# EAGLE design TZATZIKI_v4 (EAGLE 7.6.0)
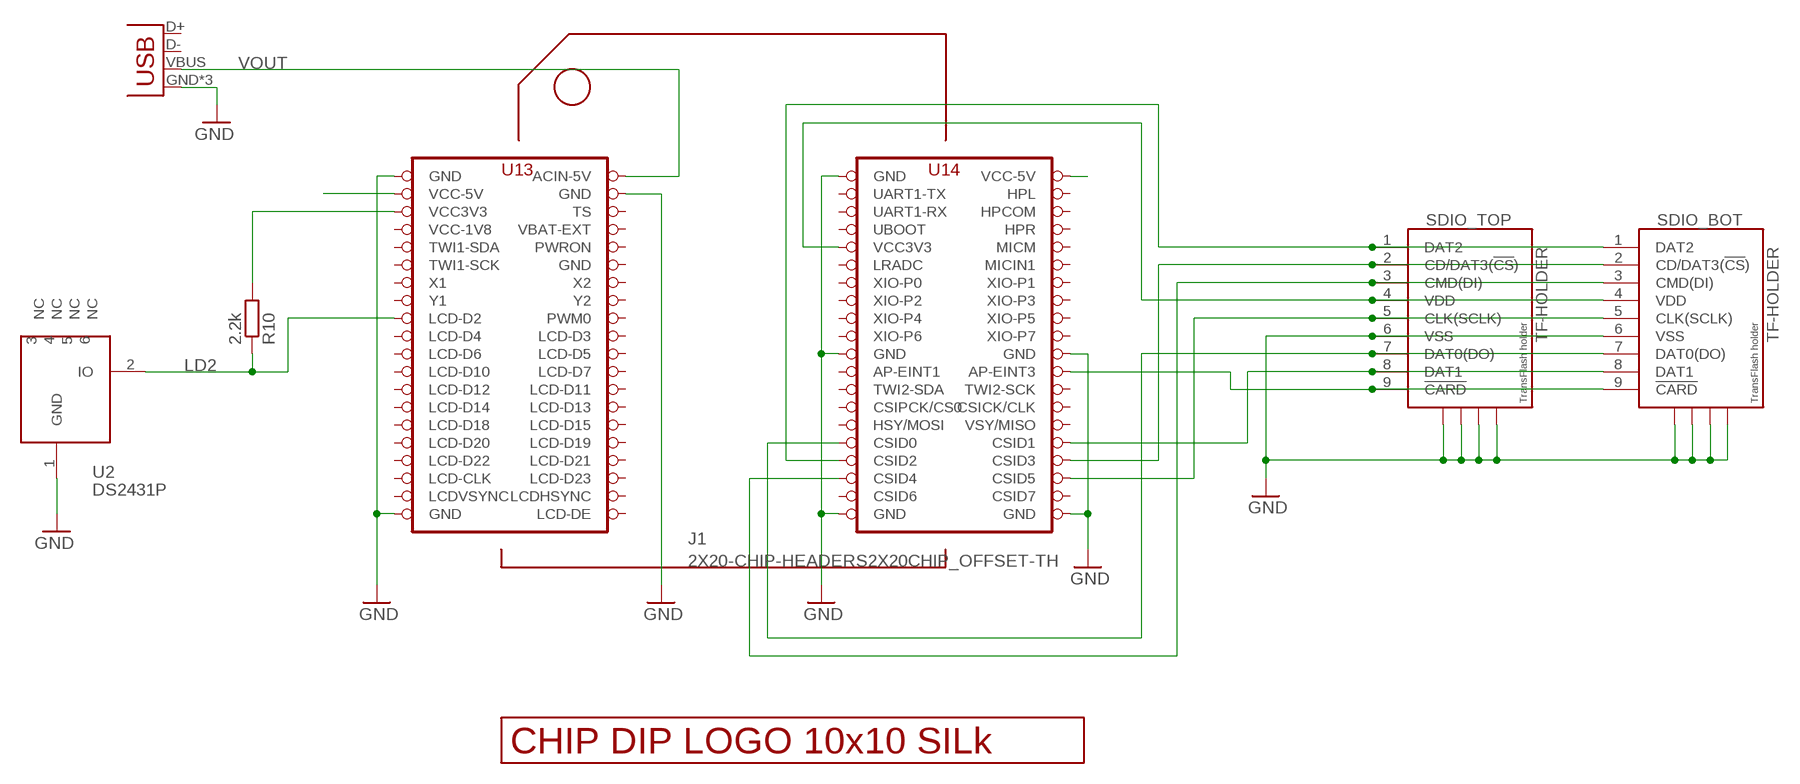
[diagram p0: schematic, sheet 1]

## Parts
J1  2X20-CHIP-HEADERS2X20CHIP_OFFSET-TH  [2X20CHIP_OFFSET-TH]
POWER_USB  USBUSB-MICROB-SMT-DIP  [USB-MICROB-SMT-DIP]
R10  2.2k  R-EU_R0805  [R0805]
SDIO_BOT  TF-HOLDER  [TF-PULL]
SDIO_TOP  TF-HOLDER  [TF-PULL]
U2  DS2431P  [TSOC6]
U$1  LOGO_10X10_SILK  [LOGO_10X10_SILK]

## Nets
GND: J1.GND@1(GND) J1.GND@2(GND) J1.GND@4(GND) J1.GND@5(GND) J1.GND@6(GND) J1.GND@7(GND) J1.GND@8(GND) J1.GND@10(GND) POWER_USB.GND POWER_USB.MT1(GND) POWER_USB.MT2(GND) SDIO_BOT.6(VSS) SDIO_BOT.S1 SDIO_BOT.S2 SDIO_BOT.S3 SDIO_BOT.S4 SDIO_TOP.6(VSS) SDIO_TOP.S1 SDIO_TOP.S2 SDIO_TOP.S3 SDIO_TOP.S4 U2.1(GND)
LD2: J1.LCD-D2 R10.1 U2.2(IO)
N$1: J1.VCC3V3 R10.2
N$2: J1.CSID3 SDIO_BOT.2(CD/DAT3(!CS!)) SDIO_TOP.2(CD/DAT3(!CS!))
N$3: J1.CSID0 SDIO_BOT.7(DAT0(DO)) SDIO_TOP.7(DAT0(DO))
N$4: J1.CSID4 SDIO_BOT.3(CMD(DI)) SDIO_TOP.3(CMD(DI))
N$5: J1.CSID5 SDIO_BOT.5(CLK(SCLK)) SDIO_TOP.5(CLK(SCLK))
N$6: J1.CSID1 SDIO_BOT.8(DAT1) SDIO_TOP.8(DAT1)
N$7: J1.VCC5V@1(VCC-5V)
N$8: J1.VCC5V@0(VCC-5V)
N$9: J1.CSID2 SDIO_BOT.1(DAT2) SDIO_TOP.1(DAT2)
N$10: J1.VCC3V3@1(VCC3V3) SDIO_BOT.4(VDD) SDIO_TOP.4(VDD)
N$16: J1.AP-EINT3 SDIO_BOT.9(!CARD) SDIO_TOP.9(!CARD)
VOUT: J1.CHG-IN(ACIN-5V) POWER_USB.VBUS
Unconnected: J1.AP-EINT1 J1.BAT(VBAT-EXT) J1.CSICK(CSICK/CLK) J1.CSID6 J1.CSID7 J1.CSIHSYNC(HSY/MOSI) J1.CSIPCK(CSIPCK/CS0) J1.CSIVSYNC(VSY/MISO) J1.FEL(UBOOT) J1.HPCOM J1.HPL J1.HPR J1.LCD-CLK J1.LCD-D3 J1.LCD-D4 J1.LCD-D5 J1.LCD-D6 J1.LCD-D7 J1.LCD-D10 J1.LCD-D11 J1.LCD-D12 J1.LCD-D13 J1.LCD-D14 J1.LCD-D15 J1.LCD-D18 J1.LCD-D19 J1.LCD-D20 J1.LCD-D21 J1.LCD-D22 J1.LCD-D23 J1.LCD-DE J1.LCD-HSYNC(LCDHSYNC) J1.LCD-VSYNC(LCDVSYNC) J1.LRADC J1.MICIN1 J1.MICM J1.PWM0 J1.PWRON J1.TS J1.TWI1-SCK J1.TWI1-SDA J1.TWI2-SCK J1.TWI2-SDA J1.UART1-RX J1.UART1-TX J1.X1 J1.X2 J1.XIO-P0 J1.XIO-P1 J1.XIO-P2 J1.XIO-P3 J1.XIO-P4 J1.XIO-P5 J1.XIO-P6 J1.XIO-P7 J1.Y1 J1.Y2 POWER_USB.D+ POWER_USB.D- U2.3(NC) U2.4(NC) U2.5(NC) U2.6(NC)

## Power pins joined to a net without a drawn wire
GND: J1.GND@3(GND)
VCC-1V8: J1.VCC1V8(VCC-1V8)

## Library data of the parts
J1 = JKW_CHIP:2X20-CHIP-HEADERS: Through hole layout with chip reference
POWER_USB = Spark:USB
R10 = rcl:R-EU_: RESISTOR, European symbol
SDIO_BOT SDIO_TOP = JKW_CHIP:TF-HOLDER: TF / Micro SD socket is PUSH-PUSH type, the card can be pushed into and auto locked and pushed out by simply press the card. Surface Mounting type.
U2 = JKW_CHIP:DS2431: 1024-Bit EEPROM This chip provides a 4x256 Bit EEPROM, which can be programmed@5V. Write protection and OTP emulation are available, too. Author: Jan Kandziora <jjj@gmx.de>; DESCRIPTION: IC, 1024-Bit, 1-Wire EEPROM, TSOC6; FOOTPRINT: TSOC6; LINK: http://www.digikey.com/product-detail/en/DS2431P%2BT%26R/DS2431P%2BT%26RCT-ND/3647900; MFG: DIGIKEY; MFG_PN: DS2431P+T&RCT-ND; PART_TYPE: IC; PRICE: 0.98; VENDOR: MAXIM; VENDOR_PART_NUMBER: DS2431P+T&R
U$1 = JKW_CHIP:LOGO_10X10_SILK

## Board
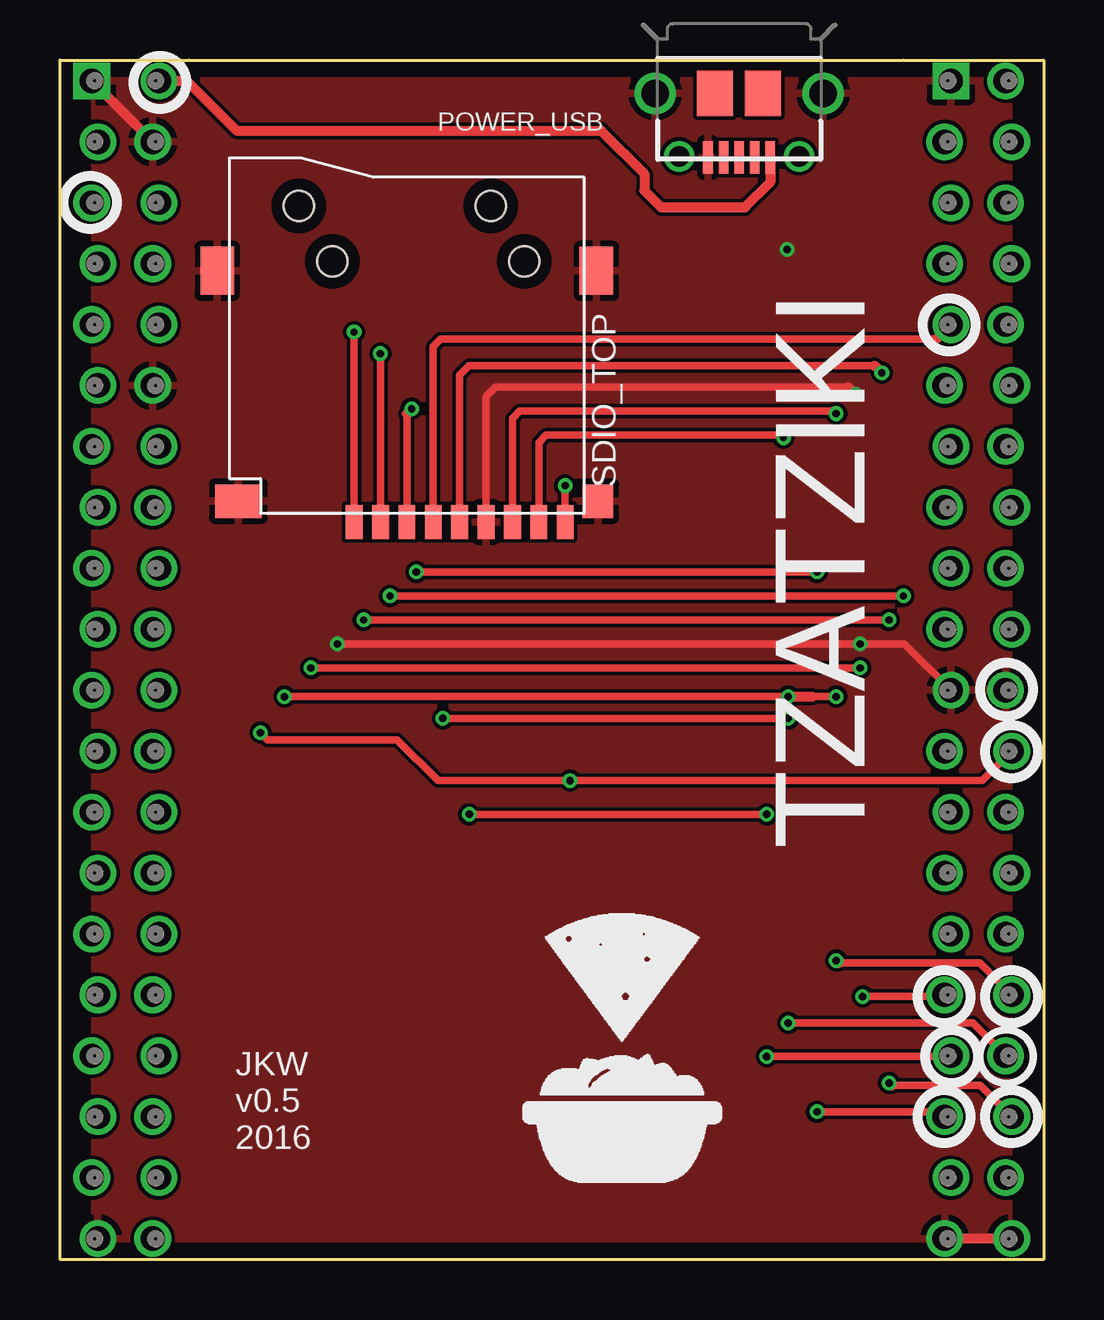
[diagram p1: board, top side]
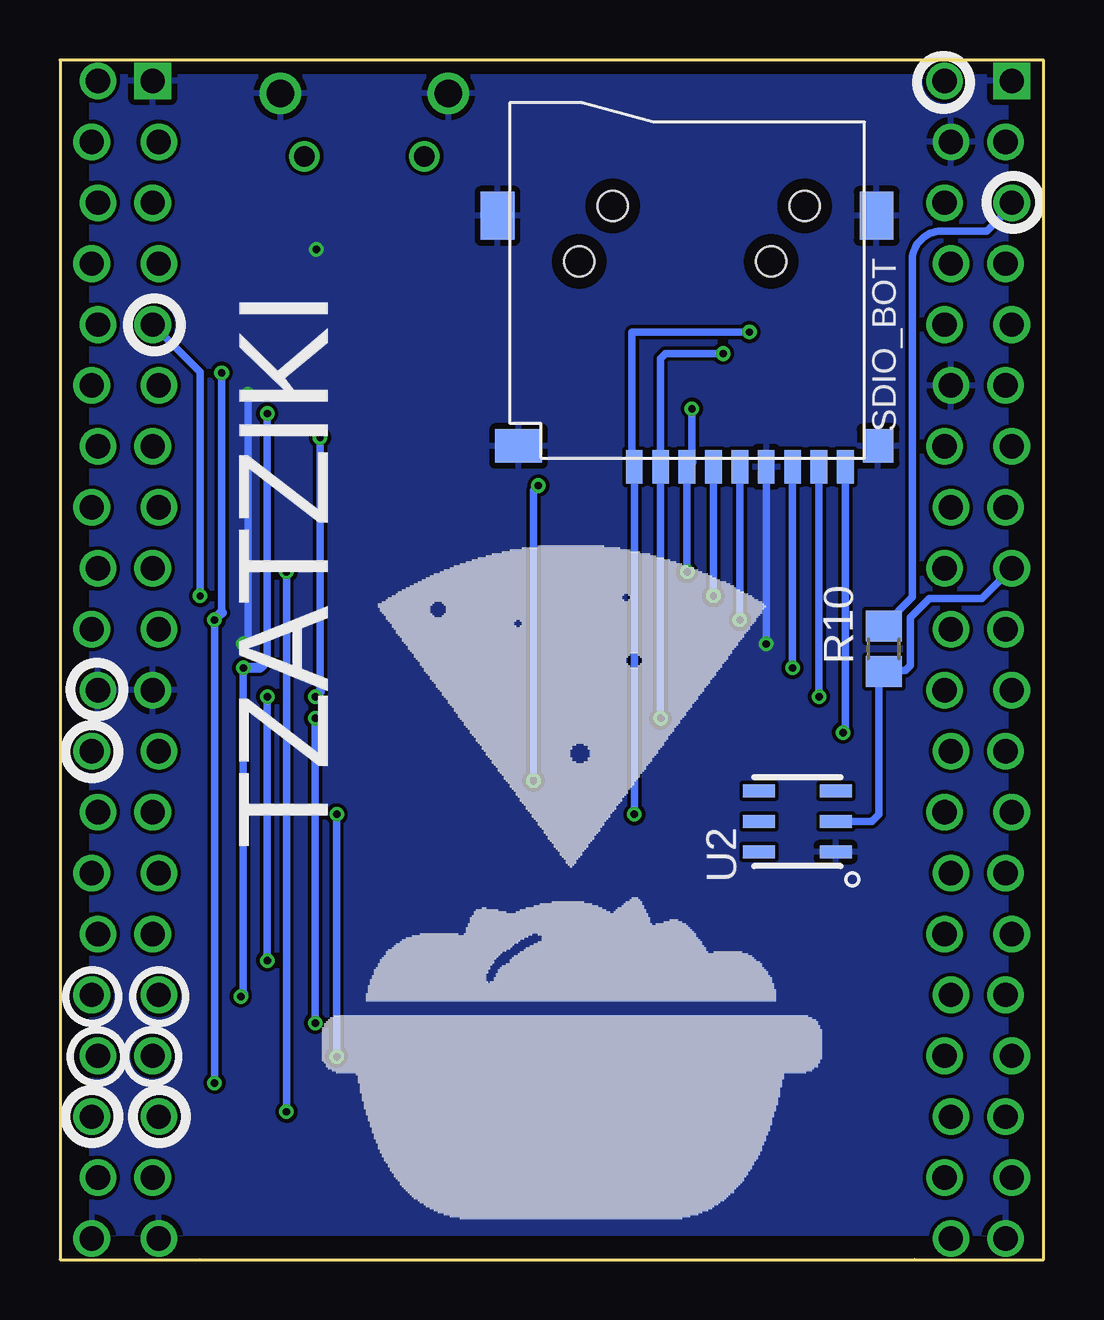
[diagram p2: board, bottom side, seen from below]

Size 41 x 50 mm. Coordinates in mm from the lower left corner, seen from the top.
Copper layers (1*16): Top 0.035mm / dielectric 1.6mm / Bottom 0.035mm
Design rules "Elecrow_2-layer_PCB_eagle_rule": minimum track width 6mil, minimum drill 12mil, track to track 6mil, track to pad 6mil, pad to pad 6mil, via to via 8mil, smd to smd 0mil, copper to edge 20mil, drill to drill 10mil, minimum pad ring 6mil, minimum via ring 6mil, stop-mask expansion 0mil, vias tented up to drill 100mil, thermal gap 10mil

### Footprints (pad centres in the part's own frame; a part is rotated, then mirrored left to right if it is on the bottom)
2X20CHIP_OFFSET-TH = drill 1.016: AP-EINT1 15.113,-3.81; AP-EINT3 17.907,-3.81; BAT -17.907,16.51; CHG-IN -17.653,24.13; CSICK 17.907,-8.89; CSID0 15.113,-13.97; CSID1 17.907,-13.97; CSID2 15.367,-16.51; CSID3 17.653,-16.51; CSID4 15.113,-19.05; CSID5 17.907,-19.05; CSID6 15.367,-21.59; CSID7 17.653,-21.59; CSIHSYNC 15.367,-11.43; CSIPCK 15.113,-8.89; CSIVSYNC 17.653,-11.43; FEL 15.113,16.51; GND@1 -17.907,11.43; GND@2 -20.193,-24.13; GND@4 17.653,-1.27; GND@5 17.907,-24.13; GND@6 15.113,-24.13; GND@7 15.367,-1.27; GND@10 -17.907,21.59; HPCOM 17.653,19.05; HPL 17.907,21.59; HPR 17.907,16.51; LCD-CLK -20.193,-19.05; LCD-D2 -20.447,3.81; LCD-D3 -17.907,1.27; LCD-D4 -20.193,1.27; LCD-D5 -17.653,-1.27; LCD-D6 -20.447,-1.27; LCD-D7 -17.907,-3.81; LCD-D10 -20.193,-3.81; LCD-D11 -17.653,-6.35; LCD-D12 -20.447,-6.35; LCD-D13 -17.907,-8.89; LCD-D14 -20.193,-8.89; LCD-D15 -17.653,-11.43; LCD-D18 -20.447,-11.43; LCD-D19 -17.907,-13.97; LCD-D20 -20.193,-13.97; LCD-D21 -17.653,-16.51; LCD-D22 -20.447,-16.51; LCD-D23 -17.907,-19.05; LCD-DE -17.907,-24.13; LCD-HSYNC -17.653,-21.59; LCD-VSYNC -20.447,-21.59; LRADC 15.113,11.43; MICIN1 17.907,11.43; MICM 17.653,13.97; PWM0 -17.653,3.81; PWRON -17.653,13.97; TS -17.653,19.05; TWI1-SCK -20.193,11.43; TWI1-SDA -20.447,13.97; TWI2-SCK 17.653,-6.35; TWI2-SDA 15.367,-6.35; UART1-RX 15.367,19.05; UART1-TX 15.113,21.59; VCC1V8 -20.193,16.51; VCC3V3 -20.447,19.05; VCC3V3@1 15.367,13.97; VCC5V@0 -20.193,21.59; VCC5V@1 17.653,24.13; X1 -20.447,8.89; X2 -17.653,8.89; XIO-P0 15.367,8.89; XIO-P1 17.653,8.89; XIO-P2 15.113,6.35; XIO-P3 17.907,6.35; XIO-P4 15.367,3.81; XIO-P5 17.653,3.81; XIO-P6 15.113,1.27; XIO-P7 17.907,1.27; Y1 -20.193,6.35; Y2 -17.907,6.35 | drill 1.016 square: GND@3 -20.447,24.13; GND@8 15.367,24.13
USB-MICROB-SMT-DIP = smd 0.4 x 1.35: D+ 0,2.675; D- -0.65,2.675; GND 1.3,2.675; ID 0.65,2.675; VBUS -1.3,2.675 | drill 1.15 pad 1.7: MT1 -3.5,0; MT2 3.5,0 | drill 0.85 pad 1.25: MT3 -2.5,2.625; MT4 2.5,2.625 | smd 1.5 x 1.9: P$1 -1,0; P$2 1,0.01
R0805 = smd 1.3 x 1.5: 1 -0.95,0; 2 0.95,0
TF-PULL = smd 0.7 x 1.4: 1 -2.2,-7.62; 2 -1.1,-7.62; 3 0,-7.62; 4 1.1,-7.62; 5 2.2,-7.62; 6 3.3,-7.62; 7 4.4,-7.62; 8 5.5,-7.62; 9 6.6,-7.62 | smd 1.4 x 2: S1 -7.9,2.85; S2 7.9,2.85 | smd 1.28 x 1.4: S3 7.96,-6.75 | smd 1.95 x 1.4: S4 -7.025,-6.75 | hole 1.25: -3.1,3.25; 4.9,3.25
TSOC6 = smd 0.53 x 1.33: 1 -1.27,-1.6; 2 0,-1.6; 3 1.27,-1.6; 4 1.27,1.6; 5 0,1.6; 6 -1.27,1.6

### Placement (x,y rotation side)
J1  21.77,25 0 top
POWER_USB  28.31,48.61 180 top
R10  6.66,25.46 90 bottom
SDIO_BOT  14.86,40.66 0 bottom
SDIO_TOP  14.46,38.36 0 top
U2  10.26,18.26 90 bottom
U$1  19.26,3.19 0 top
U$2  LOGO_25X25_SILK  [LOGO_25X25_SILK]  30.11,1.64 0 bottom

### Tracks (layer width: path | path; a pad name or v marks a point on that pad's centre or on a via)
GND  (via drill 0.3)
  Top 0.305: v11.56,25.66 v33.36,25.66 35.21,25.66 J1.GND@7 | SDIO_TOP.6 17.76,35.96 18.16,36.36 32.86,36.36
  Top 0.406: J1.GND@3 J1.GND@10 | J1.GND@5 J1.GND@6 | 32.86,36.36 v33.16,36.06
  Bottom 0.305: SDIO_BOT.6 v11.56,25.66 | v33.16,36.06 33.16,25.86
  Bottom 0.406: 33.16,25.86 v33.36,25.66
  other vias: 30.31,42.11
  pour Top: 1.45,0.87 39.55,0.87 39.55,49.13 1.45,49.13
  pour Bottom: 39.67,1.12 1.57,1.12 1.57,49.38 39.67,49.38
LD2
  Bottom 0.305: J1.LCD-D2 2.57,27.56 4.76,27.56 5.56,26.76 5.56,24.76 5.76,24.56 6.61,24.56 R10.1 6.86,24.31 6.86,18.56 7.16,18.26 U2.2
N$1
  Bottom 0.305: R10.2 5.46,27.61 5.46,41.46 arc99 4.26,42.86 2.36,42.86 1.32,43.9 J1.VCC3V3
N$2  (via drill 0.3)
  Top 0.305: v15.96,22.56 v30.36,22.56 | v30.36,9.86 38.05,9.86 J1.CSID3 | SDIO_TOP.2 v13.36,37.76
  Bottom 0.305: v15.96,22.56 SDIO_BOT.2 15.96,37.56 15.76,37.76 v13.36,37.76 | v30.36,22.56 v30.36,9.86
N$3  (via drill 0.3)
  Top 0.305: v10.46,24.66 v33.36,24.66 | v33.46,10.96 36.81,10.96 | SDIO_TOP.7 18.86,35.06 19.16,35.36 32.26,35.36
  Top 0.406: 36.81,10.96 J1.CSID0 | 32.26,35.36 v32.36,35.26
  Bottom 0.305: SDIO_BOT.7 v10.46,24.66 | v33.36,24.66 33.36,11.06 | v32.36,35.26 32.36,24.96
  Bottom 0.406: 33.36,11.06 v33.46,10.96 | 32.36,24.96 32.66,24.66 v33.36,24.66
N$4  (via drill 0.3)
  Top 0.305: v14.86,28.66 v31.56,28.66 | v31.56,6.16 36.67,6.16 J1.CSID4 | SDIO_TOP.3 14.46,35.26
  Top 0.406: 14.46,35.26 v14.66,35.46
  Bottom 0.305: SDIO_BOT.3 v14.86,28.66 | v31.56,28.66 v31.56,6.16 | v14.66,35.46 14.66,33.24
  Bottom 0.406: 14.66,33.24 SDIO_BOT.3
N$5  (via drill 0.3)
  Top 0.305: v12.66,26.66 v34.56,26.66 | 34.66,7.26 38.37,7.26 J1.CSID5 | SDIO_TOP.5 16.66,36.86 17.06,37.26 33.96,37.26
  Top 0.406: v34.56,7.36 34.66,7.26 | 33.96,37.26 v34.26,36.96
  Bottom 0.305: SDIO_BOT.5 v12.66,26.66 | v34.56,26.66 v34.56,7.36 | v34.26,36.96 34.26,26.96
  Bottom 0.406: 34.26,26.96 v34.56,26.66
N$6  (via drill 0.3)
  Top 0.305: v9.36,23.46 v30.36,23.46 | 31.36,23.46 v32.36,23.46 | 32.46,12.36 38.35,12.36 J1.CSID1 | SDIO_TOP.8 19.96,34.06 20.26,34.36 30.06,34.36
  Top 0.406: v32.36,12.46 32.46,12.36 | 30.06,34.36 v30.16,34.26 | v30.36,23.46 31.36,23.46
  Bottom 0.305: SDIO_BOT.8 v9.36,23.46 | v32.36,23.46 v32.36,12.46 | v30.16,34.26 30.16,23.66
  Bottom 0.406: 30.16,23.66 v30.36,23.46
N$9  (via drill 0.3)
  Top 0.305: v17.06,18.56 v29.46,18.56 | v29.46,8.46 37.11,8.46 | SDIO_TOP.1 v12.26,38.66
  Top 0.406: 37.11,8.46 J1.CSID2
  Bottom 0.305: SDIO_BOT.1 v17.06,18.56 | v29.46,18.56 v29.46,8.46 | v12.26,38.66 17.16,38.66 17.16,33.14
  Bottom 0.406: 17.16,33.14 SDIO_BOT.1
N$10  (via drill 0.3)
  Top 0.305: v13.76,27.66 v35.16,27.66 | SDIO_TOP.4 15.56,38.06 15.86,38.36 36.53,38.36
  Top 0.406: 36.53,38.36 J1.VCC3V3@1
  Bottom 0.305: SDIO_BOT.4 v13.76,27.66 | v35.16,27.66 35.16,36.99 J1.VCC3V3@1
  Bottom 0.406: 37,39.11 J1.VCC3V3@1
N$16  (via drill 0.3)
  Top 0.305: J1.AP-EINT3 38.45,19.96 22.26,19.96 v21.26,19.96 15.76,19.96 14.06,21.66 8.66,21.66 v8.36,21.96 | SDIO_TOP.9 v21.06,32.26
  Bottom 0.305: v8.36,21.96 8.26,22.06 SDIO_BOT.9 | v21.06,32.26 21.26,32.06 v21.26,19.96
VOUT
  Top 0.406: POWER_USB.VBUS 29.61,44.91 28.56,43.86 25.06,43.86 24.36,44.56 24.36,45.26 22.56,47.06 7.36,47.06 5.29,49.13 J1.CHG-IN

### Text on the board
Unrouted: Not Ordered
tNames: TZATZIKI | JKW / v0.5 / 2016
bNames: TZATZIKI